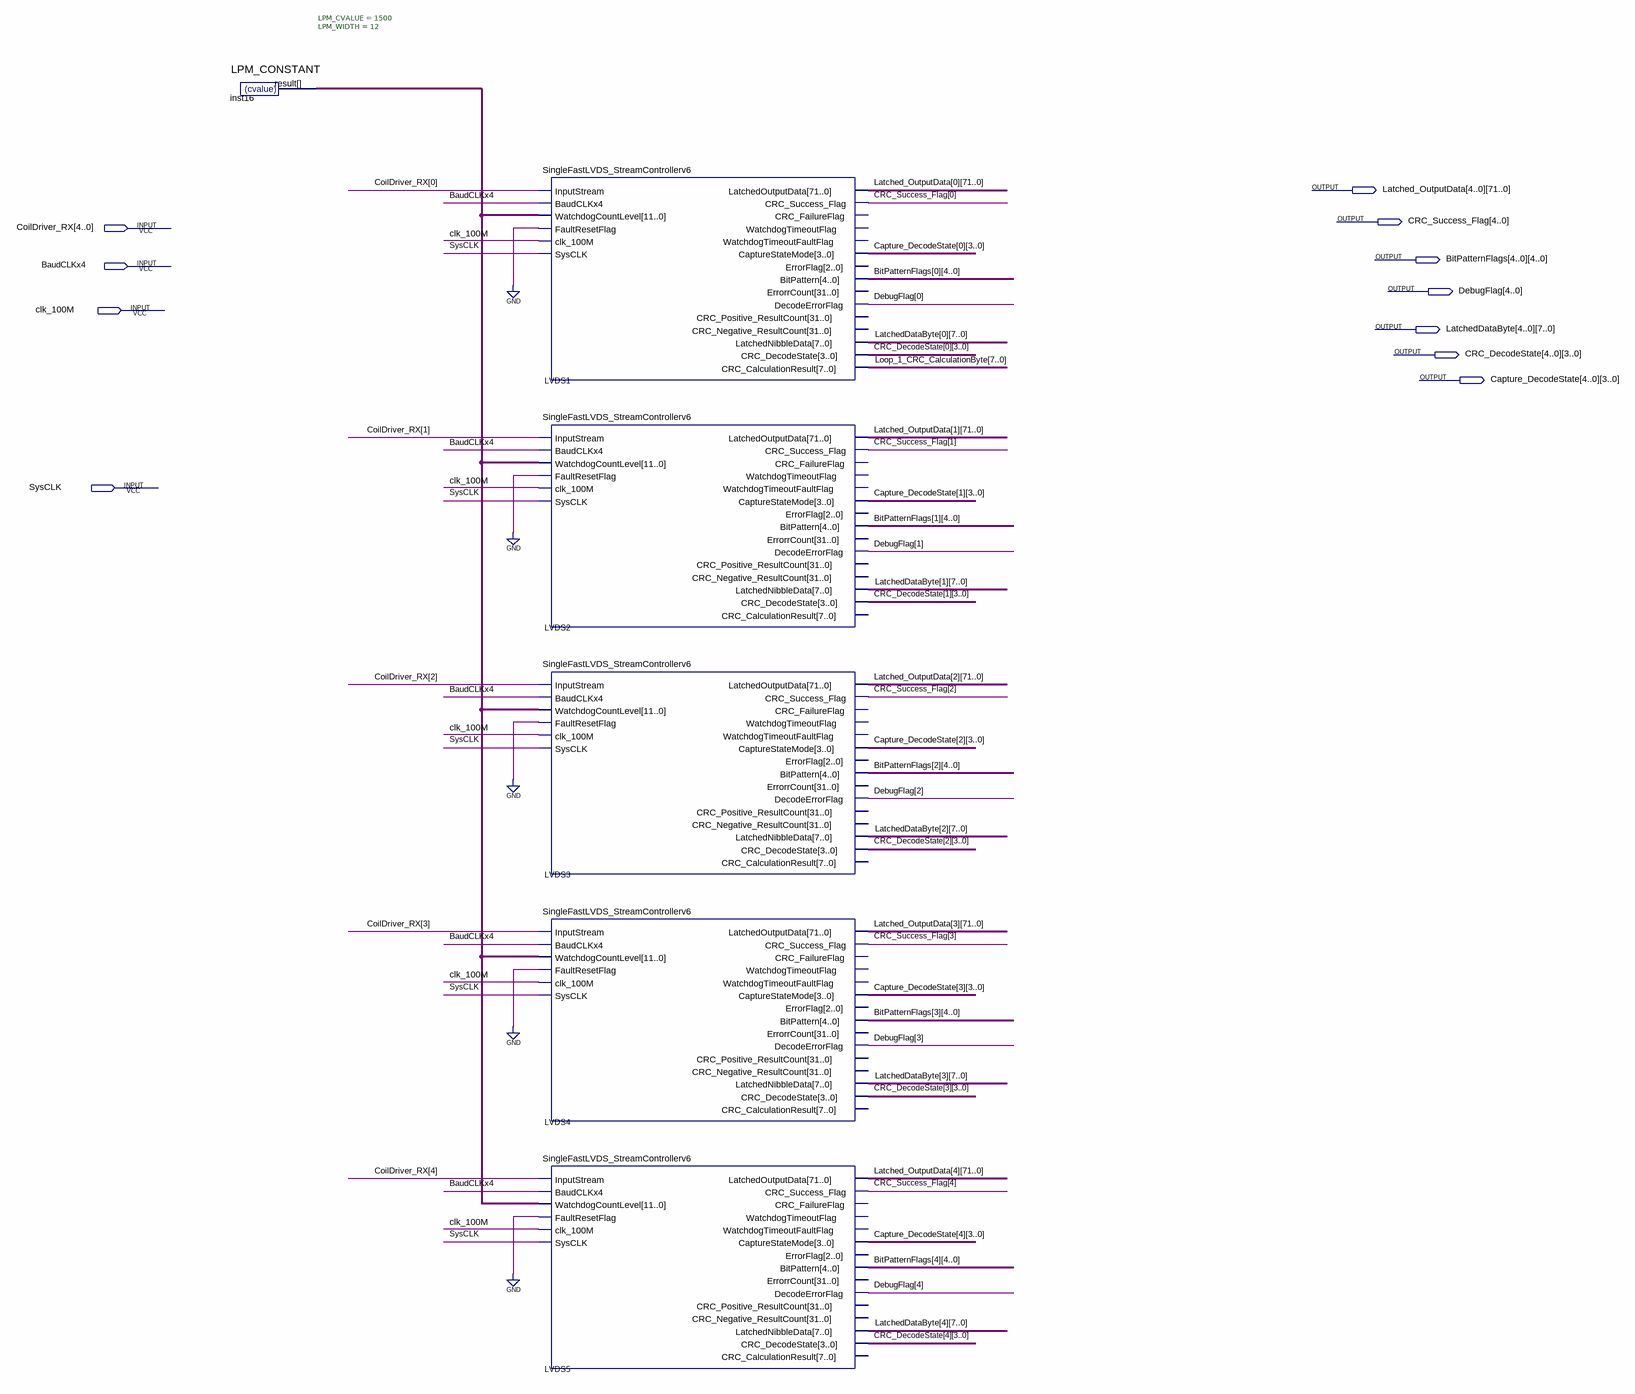
[diagram p0: schematic sheet]
// Quartus schematic ChannelFeedbackFast4B5BChannels.bdf as structural Verilog: 6 symbols, 11 pins
module ChannelFeedbackFast4B5BChannels (
  input  [4:0] CoilDriver_RX,
  input  BaudCLKx4,
  input  clk_100M,
  input  SysCLK,
  output [71:0] Latched_OutputData_4,
  output [71:0] Latched_OutputData_3,
  output [71:0] Latched_OutputData_2,
  output [71:0] Latched_OutputData_1,
  output [71:0] Latched_OutputData_0,
  output [4:0] CRC_Success_Flag,
  output [4:0] BitPatternFlags_4,
  output [4:0] BitPatternFlags_3,
  output [4:0] BitPatternFlags_2,
  output [4:0] BitPatternFlags_1,
  output [4:0] BitPatternFlags_0,
  output [4:0] DebugFlag,
  output [7:0] LatchedDataByte_4,
  output [7:0] LatchedDataByte_3,
  output [7:0] LatchedDataByte_2,
  output [7:0] LatchedDataByte_1,
  output [7:0] LatchedDataByte_0,
  output [3:0] CRC_DecodeState_4,
  output [3:0] CRC_DecodeState_3,
  output [3:0] CRC_DecodeState_2,
  output [3:0] CRC_DecodeState_1,
  output [3:0] CRC_DecodeState_0,
  output [3:0] Capture_DecodeState_4,
  output [3:0] Capture_DecodeState_3,
  output [3:0] Capture_DecodeState_2,
  output [3:0] Capture_DecodeState_1,
  output [3:0] Capture_DecodeState_0
);

  wire [7:0] Loop_1_CRC_CalculationByte;
  wire [11:0] inst16_result;

  LPM_CONSTANT #(.LPM_CVALUE(1500), .LPM_WIDTH(12)) inst16 (.result(inst16_result));
  SingleFastLVDS_StreamControllerv6 LVDS1 (
    .InputStream(CoilDriver_RX[0]), .BaudCLKx4(BaudCLKx4), .WatchdogCountLevel(inst16_result),
    .FaultResetFlag(1'b0), .clk_100M(clk_100M), .SysCLK(SysCLK), .LatchedOutputData(Latched_OutputData_0),
    .CRC_Success_Flag(CRC_Success_Flag[0]), .CaptureStateMode(Capture_DecodeState_0),
    .BitPattern(BitPatternFlags_0), .DecodeErrorFlag(DebugFlag[0]), .LatchedNibbleData(LatchedDataByte_0),
    .CRC_DecodeState(CRC_DecodeState_0), .CRC_CalculationResult(Loop_1_CRC_CalculationByte));  // open: CRC_FailureFlag, WatchdogTimeoutFlag, WatchdogTimeoutFaultFlag, ErrorFlag, ErrorrCount, CRC_Positive_ResultCount, CRC_Negative_ResultCount
  SingleFastLVDS_StreamControllerv6 LVDS2 (
    .InputStream(CoilDriver_RX[1]), .BaudCLKx4(BaudCLKx4), .WatchdogCountLevel(inst16_result),
    .FaultResetFlag(1'b0), .clk_100M(clk_100M), .SysCLK(SysCLK), .LatchedOutputData(Latched_OutputData_1),
    .CRC_Success_Flag(CRC_Success_Flag[1]), .CaptureStateMode(Capture_DecodeState_1),
    .BitPattern(BitPatternFlags_1), .DecodeErrorFlag(DebugFlag[1]), .LatchedNibbleData(LatchedDataByte_1),
    .CRC_DecodeState(CRC_DecodeState_1));  // open: CRC_FailureFlag, WatchdogTimeoutFlag, WatchdogTimeoutFaultFlag, ErrorFlag, ErrorrCount, CRC_Positive_ResultCount, CRC_Negative_ResultCount, CRC_CalculationResult
  SingleFastLVDS_StreamControllerv6 LVDS3 (
    .InputStream(CoilDriver_RX[2]), .BaudCLKx4(BaudCLKx4), .WatchdogCountLevel(inst16_result),
    .FaultResetFlag(1'b0), .clk_100M(clk_100M), .SysCLK(SysCLK), .LatchedOutputData(Latched_OutputData_2),
    .CRC_Success_Flag(CRC_Success_Flag[2]), .CaptureStateMode(Capture_DecodeState_2),
    .BitPattern(BitPatternFlags_2), .DecodeErrorFlag(DebugFlag[2]), .LatchedNibbleData(LatchedDataByte_2),
    .CRC_DecodeState(CRC_DecodeState_2));  // open: CRC_FailureFlag, WatchdogTimeoutFlag, WatchdogTimeoutFaultFlag, ErrorFlag, ErrorrCount, CRC_Positive_ResultCount, CRC_Negative_ResultCount, CRC_CalculationResult
  SingleFastLVDS_StreamControllerv6 LVDS4 (
    .InputStream(CoilDriver_RX[3]), .BaudCLKx4(BaudCLKx4), .WatchdogCountLevel(inst16_result),
    .FaultResetFlag(1'b0), .clk_100M(clk_100M), .SysCLK(SysCLK), .LatchedOutputData(Latched_OutputData_3),
    .CRC_Success_Flag(CRC_Success_Flag[3]), .CaptureStateMode(Capture_DecodeState_3),
    .BitPattern(BitPatternFlags_3), .DecodeErrorFlag(DebugFlag[3]), .LatchedNibbleData(LatchedDataByte_3),
    .CRC_DecodeState(CRC_DecodeState_3));  // open: CRC_FailureFlag, WatchdogTimeoutFlag, WatchdogTimeoutFaultFlag, ErrorFlag, ErrorrCount, CRC_Positive_ResultCount, CRC_Negative_ResultCount, CRC_CalculationResult
  SingleFastLVDS_StreamControllerv6 LVDS5 (
    .InputStream(CoilDriver_RX[4]), .BaudCLKx4(BaudCLKx4), .WatchdogCountLevel(inst16_result),
    .FaultResetFlag(1'b0), .clk_100M(clk_100M), .SysCLK(SysCLK), .LatchedOutputData(Latched_OutputData_4),
    .CRC_Success_Flag(CRC_Success_Flag[4]), .CaptureStateMode(Capture_DecodeState_4),
    .BitPattern(BitPatternFlags_4), .DecodeErrorFlag(DebugFlag[4]), .LatchedNibbleData(LatchedDataByte_4),
    .CRC_DecodeState(CRC_DecodeState_4));  // open: CRC_FailureFlag, WatchdogTimeoutFlag, WatchdogTimeoutFaultFlag, ErrorFlag, ErrorrCount, CRC_Positive_ResultCount, CRC_Negative_ResultCount, CRC_CalculationResult
endmodule
